# Altium schematic sheet Channel.SchDoc
size A3
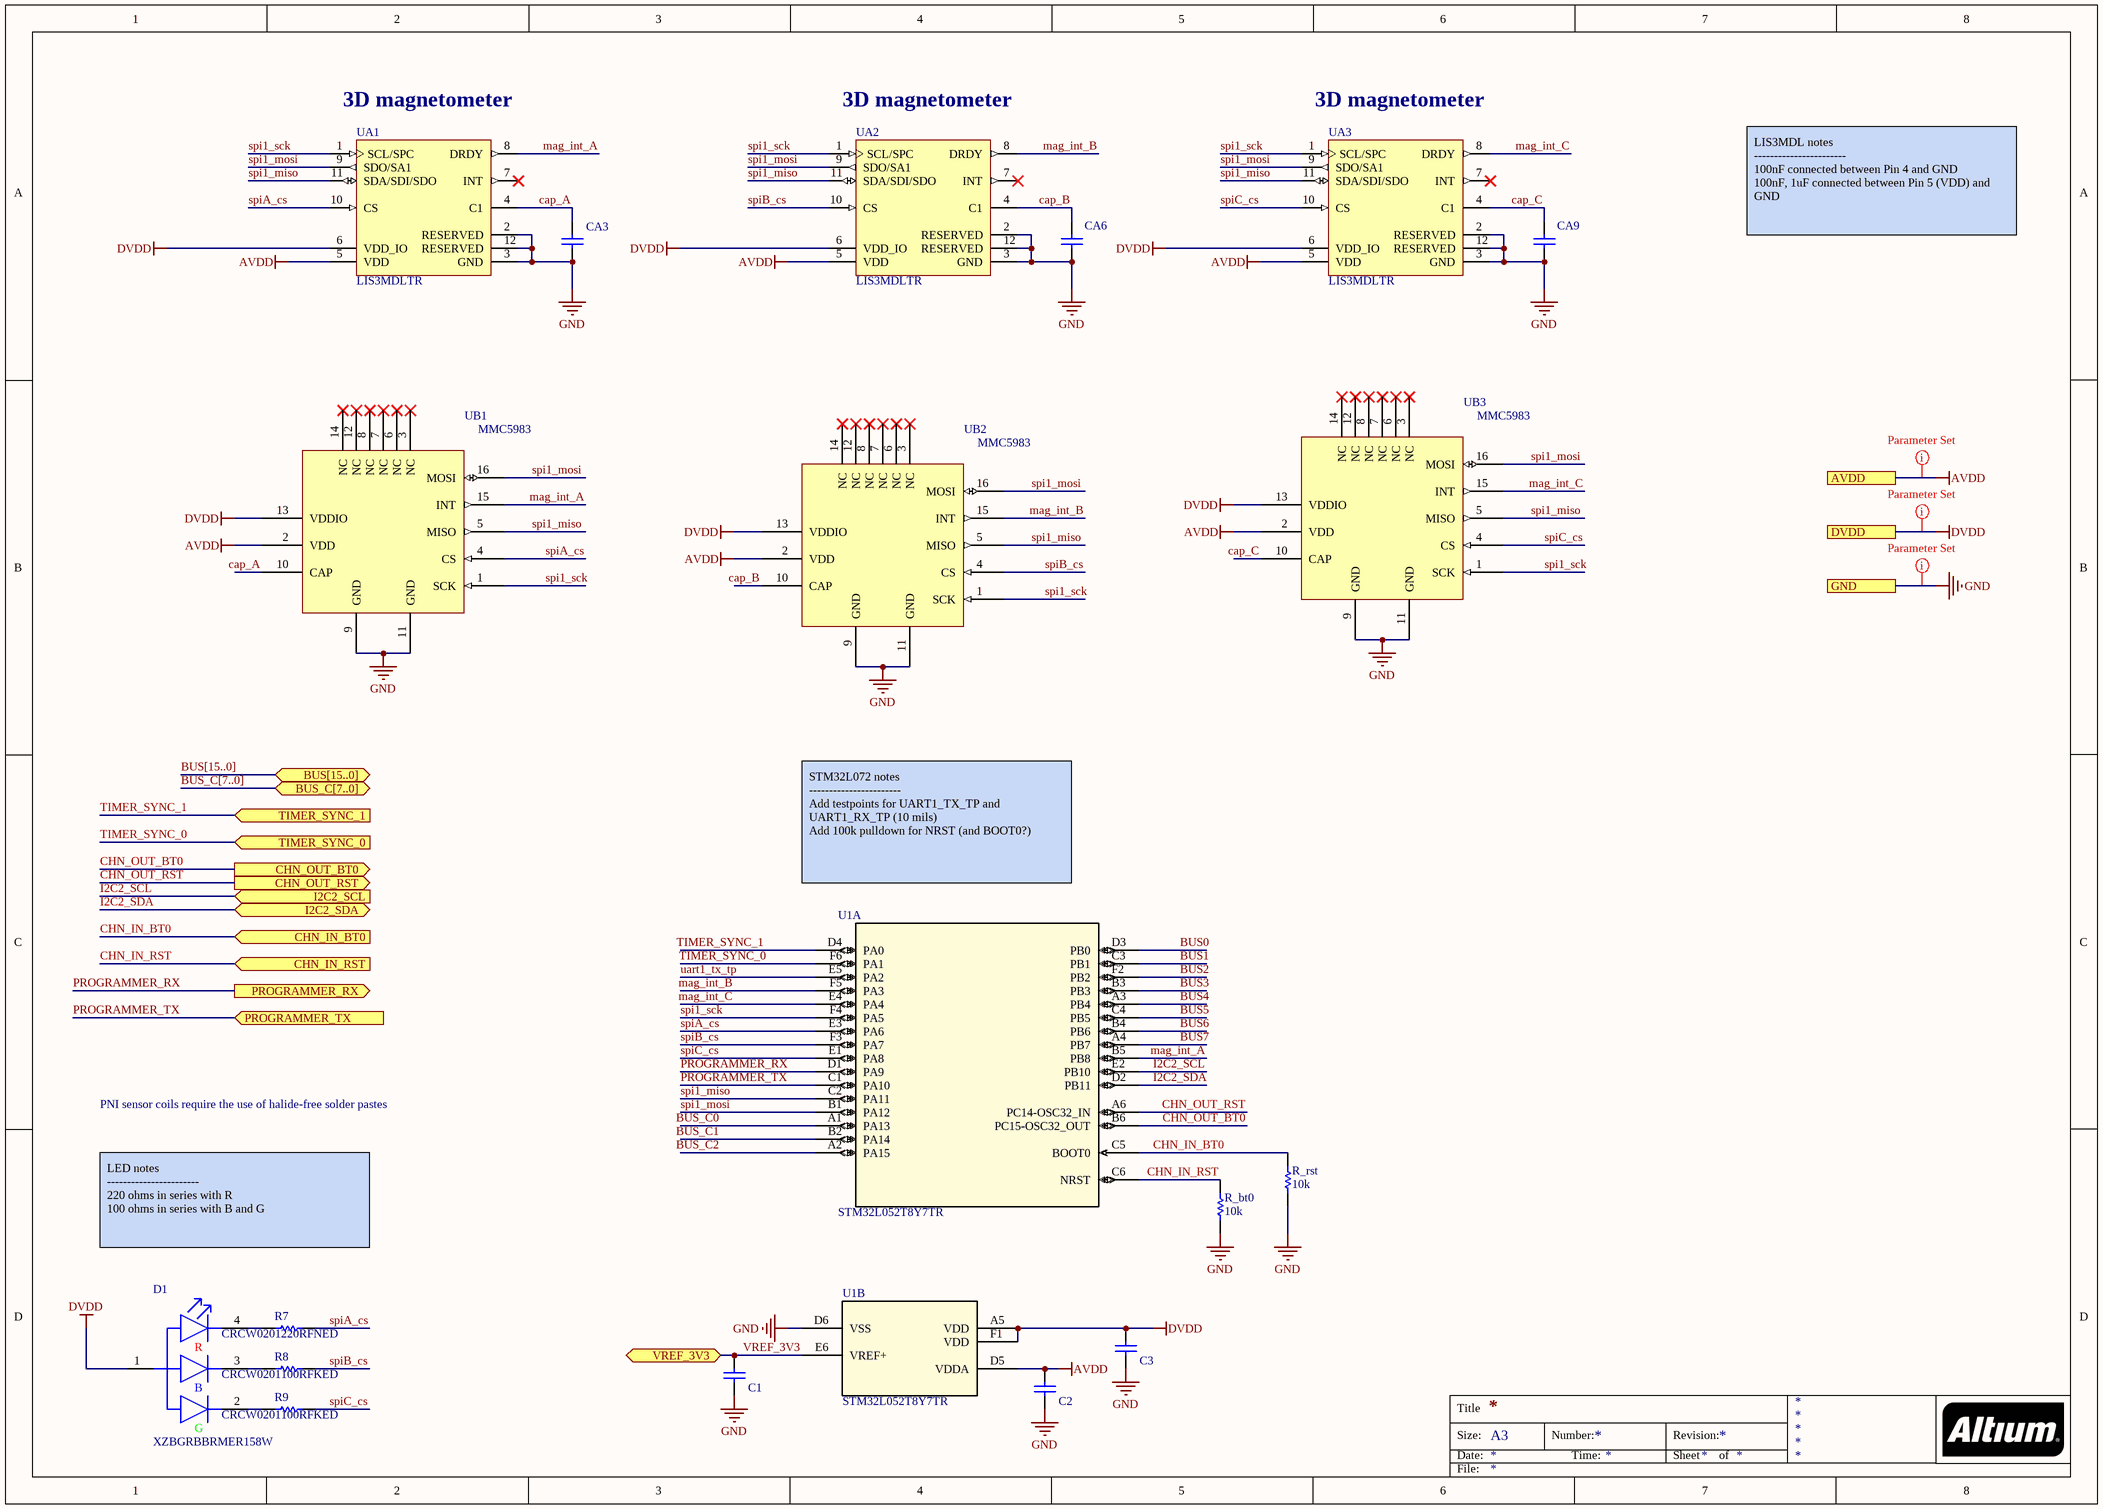
[diagram p0: Channel.SchDoc]

## Parts
C1  GRM155R71C104KA88D  [CAPC1005X55X25NL05T10]  (value not drawn)
C2  GRM155R71C104KA88D  [CAPC1005X55X25NL05T10]  (value not drawn)
C3  GRM155R71C104KA88D  [CAPC1005X55X25NL05T10]  (value not drawn)
CA3  GRM155R71C104KA88D  [CAPC1005X55X25NL05T10]  (value not drawn)
CA6  GRM155R71C104KA88D  [CAPC1005X55X25NL05T10]  (value not drawn)
CA9  GRM155R71C104KA88D  [CAPC1005X55X25NL05T10]  (value not drawn)
D1  XZBGRBBRMER158W  [4-SMD]
R7  CRCW0201220RFNED  [RESC0603X28X15LL05T05]
R8  CRCW0201100RFKED  [RESC0603X28X15LL05T05]
R9  CRCW0201100RFKED  [RESC0603X28X15LL05T05]
R_bt0  10k  [RESC0603X28X15LL05T05]
R_rst  10k  [RESC0603X28X15LL05T05]
U1  STM32L052T8Y7TR  [WLCSP36L_DIE417]  (parts A,B of 2)
UA1  LIS3MDLTR  [STM-LGA-12]
UA2  LIS3MDLTR  [STM-LGA-12]
UA3  LIS3MDLTR  [STM-LGA-12]
UB1  MMC5983  [LGA_16]
UB2  MMC5983  [LGA_16]
UB3  MMC5983  [LGA_16]

## Ports
AVDD, BUS[15..0] (bidir), BUS_C[7..0] (bidir), CHN_IN_BT0 (in), CHN_IN_RST (in), CHN_OUT_BT0 (out), CHN_OUT_RST (out), DVDD, GND, I2C2_SCL (in), I2C2_SDA (bidir), PROGRAMMER_RX (out), PROGRAMMER_TX (in), TIMER_SYNC_0 (in), TIMER_SYNC_1 (in), VREF_3V3 (bidir)

## Nets
AVDD: C2.2 U1.D5(VDDA) UA1.5(VDD) UA2.5(VDD) UA3.5(VDD) UB1.2(VDD) UB2.2(VDD) UB3.2(VDD) ; port AVDD
DVDD: C3.2 D1.1 U1.A5(VDD) U1.F1(VDD) UA1.6(VDD_IO) UA2.6(VDD_IO) UA3.6(VDD_IO) UB1.13(VDDIO) UB2.13(VDDIO) UB3.13(VDDIO) ; port DVDD
GND: C1.1 C2.1 C3.1 CA3.1 CA6.1 CA9.1 R_bt0.1 R_rst.1 U1.D6(VSS) UA1.2(RESERVED) UA1.3(GND) UA1.12(RESERVED) UA2.2(RESERVED) UA2.3(GND) UA2.12(RESERVED) UA3.2(RESERVED) UA3.3(GND) UA3.12(RESERVED) UB1.9(GND) UB1.11(GND) UB2.9(GND) UB2.11(GND) UB3.9(GND) UB3.11(GND) ; port GND
BUS0: U1.D3(PB0)
BUS1: U1.C3(PB1)
BUS2: U1.F2(PB2)
BUS3: U1.B3(PB3)
BUS4: U1.A3(PB4)
BUS5: U1.C4(PB5)
BUS6: U1.B4(PB6)
BUS7: U1.A4(PB7)
BUS_C0: U1.A1(PA13)
BUS_C1: U1.B2(PA14)
BUS_C2: U1.A2(PA15)
cap_A: CA3.2 UA1.4(C1) UB1.10(CAP)
cap_B: CA6.2 UA2.4(C1) UB2.10(CAP)
cap_C: CA9.2 UA3.4(C1) UB3.10(CAP)
CHN_IN_BT0: R_rst.2 U1.C5(BOOT0) ; port CHN_IN_BT0
CHN_IN_RST: R_bt0.2 U1.C6(NRST) ; port CHN_IN_RST
CHN_OUT_BT0: U1.B6(PC15-OSC32_OUT) ; port CHN_OUT_BT0
CHN_OUT_RST: U1.A6(PC14-OSC32_IN) ; port CHN_OUT_RST
I2C2_SCL: U1.E2(PB10) ; port I2C2_SCL
I2C2_SDA: U1.D2(PB11) ; port I2C2_SDA
mag_int_A: U1.B5(PB8) UA1.8(DRDY) UB1.15(INT)
mag_int_B: U1.F5(PA3) UA2.8(DRDY) UB2.15(INT)
mag_int_C: U1.E4(PA4) UA3.8(DRDY) UB3.15(INT)
PROGRAMMER_RX: U1.D1(PA9) ; port PROGRAMMER_RX
PROGRAMMER_TX: U1.C1(PA10) ; port PROGRAMMER_TX
spi1_miso: U1.C2(PA11) UA1.11(SDA/SDI/SDO) UA2.11(SDA/SDI/SDO) UA3.11(SDA/SDI/SDO) UB1.5(MISO) UB2.5(MISO) UB3.5(MISO)
spi1_mosi: U1.B1(PA12) UA1.9(SDO/SA1) UA2.9(SDO/SA1) UA3.9(SDO/SA1) UB1.16(MOSI) UB2.16(MOSI) UB3.16(MOSI)
spi1_sck: U1.F4(PA5) UA1.1(SCL/SPC) UA2.1(SCL/SPC) UA3.1(SCL/SPC) UB1.1(SCK) UB2.1(SCK) UB3.1(SCK)
spiA_cs: R7.2 U1.E3(PA6) UA1.10(CS) UB1.4(CS)
spiB_cs: R8.2 U1.F3(PA7) UA2.10(CS) UB2.4(CS)
spiC_cs: R9.2 U1.E1(PA8) UA3.10(CS) UB3.4(CS)
TIMER_SYNC_0: U1.F6(PA1) ; port TIMER_SYNC_0
TIMER_SYNC_1: U1.D4(PA0) ; port TIMER_SYNC_1
uart1_tx_tp: U1.E5(PA2)
VREF_3V3: C1.2 U1.E6(VREF+) ; port VREF_3V3
NetD1_2: D1.2 R9.1
NetD1_3: D1.3 R8.1
NetD1_4: D1.4 R7.1

Not connected (* = marked no-connect by the designer): UA1 7(INT)*; UA2 7(INT)*; UA3 7(INT)*; UB1 3(NC)* 6(NC)* 7(NC)* 8(NC)* 12(NC)* 14(NC)*; UB2 3(NC)* 6(NC)* 7(NC)* 8(NC)* 12(NC)* 14(NC)*; UB3 3(NC)* 6(NC)* 7(NC)* 8(NC)* 12(NC)* 14(NC)*

## Buses and harness runs
bus BUS[15..0] = port BUS[15..0]
bus BUS_C[7..0] = port BUS_C[7..0]

## Layout directives
net class Power: AVDD, DVDD, GND

## Notes on the sheet
- (near UA1) 3D magnetometer
- (near UA2) 3D magnetometer
- (near UA3) 3D magnetometer
- LIS3MDL notes
  -----------------------
  100nF connected between Pin 4 and GND
  100nF, 1uF connected between Pin 5 (VDD) and GND
- STM32L072 notes
  -----------------------
  Add testpoints for UART1_TX_TP and UART1_RX_TP (10 mils)
  Add 100k pulldown for NRST (and BOOT0?)
- PNI sensor coils require the use of halide-free solder pastes
- LED notes
  -----------------------
  220 ohms in series with R
  100 ohms in series with B and G
- Title
- Size:
- Date:
- A3
- Number:
- Time:
- Revision:
- Sheet
- of
- File:
- (in symbol XZBGRBBRMER158W) R; B; G

## Library data of the parts
C1-C3 = CMP-2100-03641-1: Chip Capacitor, 10 uF, +/- 10%, 6 V, -55 to 125 degC, 0402 (1005 Metric), RoHS, Tape and Reel; Manufacturer: Murata; Material: Ceramic; Insulation Resistance: 10GR; Voltage: 16V; Dielectric: X7R; Capacitance: 100nF; REACH SVHC: NoSVHC; Depth: 0.5mm; Case/Package: 0402; Datasheet URL: http://psearch.en.murata.com/capacitor/product/GRM155R71C104KA88%23.pdf; Lead Free: LeadFree; Dielectric Material: Ceramic; Manufacturer URL: http://www.murata.com/; Min Operating Temperature: -55degC; Length: 1mm; Case Code (Metric): 1005; Radiation Hardening: No; Package Reference: 0402; RoHSCompliant: true; Datasheet Version: 42675.0; Thickness: 0.022inch; Packaging: TapeandReel; Voltage Rating (DC): 16V; Tolerance: 10%; Max Operating Temperature: 125degC; Package Description: 2-Pin Surface Mount Device, Body 1 x 0.5 mm; Mount: SurfaceMount; Height: 0.5mm; Width: 0.5mm; Number of Pins: 2; Voltage Rating: 16V; Case Code (Imperial): 0402; Termination: SMD/SMT; Package Quantity: 1
CA3 CA6 CA9 = CMP-2100-03641-1: Chip Capacitor, 0.1 uF, +/- 10%, 16 V, -55 to 125 degC, 0402 (1005 Metric), RoHS, Tape and Reel; Manufacturer: Murata; Dielectric Material: Ceramic; Insulation Resistance: 10GR; Voltage: 16V; Dielectric: X7R; Capacitance: 100nF; REACH SVHC: NoSVHC; Depth: 0.5mm; Case/Package: 0402; Datasheet URL: http://psearch.en.murata.com/capacitor/product/GRM155R71C104KA88%23.pdf; Lead Free: LeadFree; Material: Ceramic; Manufacturer URL: http://www.murata.com/; Min Operating Temperature: -55degC; Length: 1mm; Case Code (Metric): 1005; Radiation Hardening: No; Package Reference: 0402; RoHSCompliant: true; Datasheet Version: 42675.0; Thickness: 0.022inch; Packaging: TapeandReel; Voltage Rating (DC): 16V; Tolerance: 10%; Max Operating Temperature: 125degC; Package Description: 2-Pin Surface Mount Device, Body 1 x 0.5 mm; Mount: SurfaceMount; Height: 0.5mm; Width: 0.5mm; Number of Pins: 2; Voltage Rating: 16V; Case Code (Imperial): 0402; Termination: SMD/SMT; Package Quantity: 1
D1 = XZBGRBBRMER158W: 0.65x0.65x0.20mm (0202) Full-Color Surface Mount LED; digikey: https://www.digikey.com/en/products/detail/sunled/XZBGRBBRMER158W/8259030?s=N4IgTCBcDaIBoC0BCBxASkpaCyBRNAjAKwAcA6iALoC%2BQA
R7 = CMP-2004-00311-1: Manufacturer: Vishay Dale; Part Number: CRCW0201220RFNED; digikey: https://www.digikey.com/en/products/detail/vishay-dale/CRCW0201220RFNED/1199732?s=N4IgTCBcDaIMICU4HUAMZUEYwYQMQDkBRAERAF0BfIA
R8 R9 = CMP-2004-00005-1: Manufacturer: Vishay; Part Number: CRCW0201100RFKED; digikey: https://www.digikey.com/en/products/detail/vishay-dale/CRCW0201100RFKED/1967973?s=N4IgTCBcDaIMICU4HUAMZUEZOtQgYgNICiAIiALoC%2BQA
R_bt0 R_rst = CMP-2004-00311-1: Part Number: RC0201FR-0710KL; Manufacturer: Vishay Dale; digikey: https://www.digikey.com/en/products/detail/yageo/RC0201FR-0710KL/1948870?s=N4IgTCBcDaIEoGEAMYkEYBicC0SDsaSA0gDIgC6AvkA
U1 = STM32L052T8Y7TR: No Description Available; Vendor: STMicroelectronics; Built_By: EMA_UL_Team; SourceLibrary: STMicroelectronics_2020-10-07; Manufacturer_Part_Number: STM32L052T8Y7TR; Copyright: Copyright (C) 2018 Accelerated Designs. All rights reserved; RefDes: RefDes; Type: DEV; digikey: https://www.digikey.com/en/products/detail/stmicroelectronics/STM32L052T8Y7TR/7313146?s=N4IgTCBcDaIMoBUCyBmMAZADAVjAgHAJoDsCASiALoC%2BQA
UA1-UA3 = CMP-2000-07463-1: Digital Output Magnetic Sensor: Ultra-Low-Power, High-Performance 3-Axis Magnetometer, 1.9 to 3.6 V, -40 to 85 degC, 12-Pin LGA, RoHS, Tape and Reel; Manufacturer: STMicroelectronics; Max Supply Current: 270uA; Case\/Package: Module; Min Supply Voltage: 1.9V; Max Supply Voltage: 3.6V; Resolution: 16b; RoHSCompliant: true; Datasheet Version: Rev. 6, 05/2017; REACH SVHC: NoSVHC; Lead Free: LeadFree; Package Quantity: 8000; Package Description: 12-Pin Land Grid Array Package, Body 2 x 2 mm, Pitch 0.5 mm; Package Reference: LGA-12; Packaging: TapeandReel; Min Operating Temperature: -40degC; Mount: SurfaceMount; Contact Plating: Gold; Datasheet URL: http://www.st.com/content/ccc/resource/technical/document/datasheet/54/2a/85/76/e3/97/42/18/DM00075867.pdf/files/DM00075867.pdf/jcr:content/translations/en.DM00075867.pdf; Mounting Technology: SurfaceMount; Radiation Hardening: No; Number of Pins: 12; Max Operating Temperature: 85degC; Manufacturer URL: http://www.st.com/
  UA2: digikey: https://www.digikey.com/en/products/detail/stmicroelectronics/LIS3MDLTR/4309733?s=N4IgTCBcDaIDYEsDOBmAtgEziAugXyA
UB1-UB3 = U: MMC5983MA 3-axis magnetic sensor
  UB2: digikey: https://www.digikey.com/en/products/detail/memsic-inc/MMC5983MA/10452795?s=N4IgTCBcDaILJwMIFYCcAOAzCAugXyA